# Altium schematic sheet fxloop.SchDoc
size A4
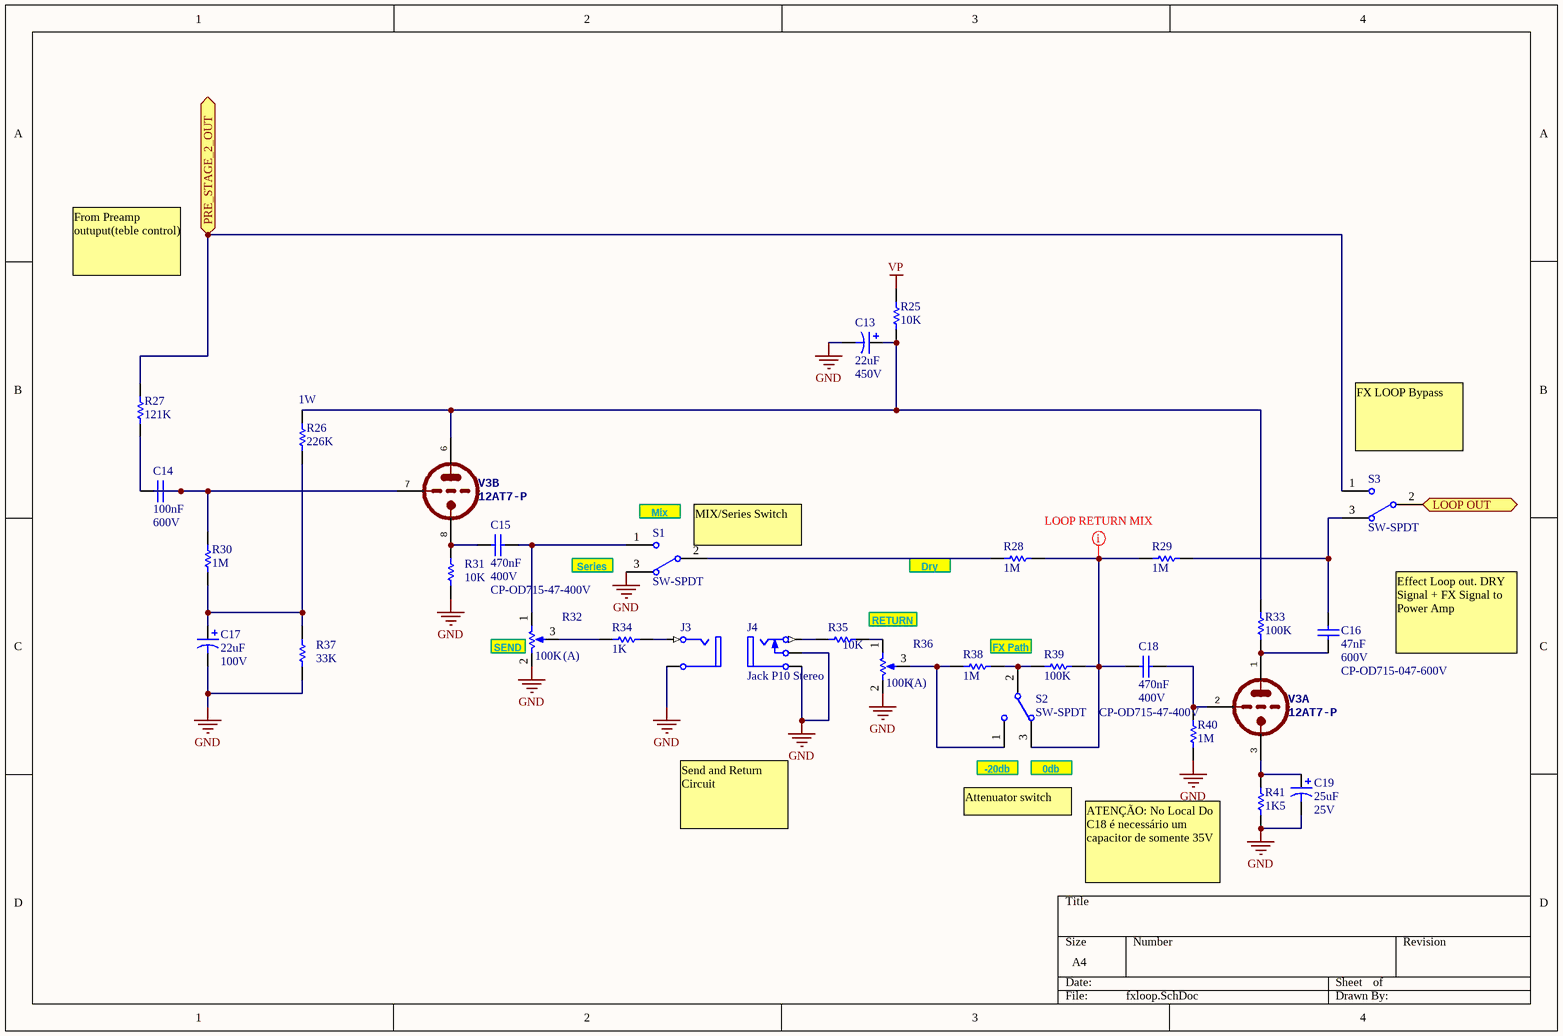
[diagram p0: fxloop.SchDoc]

## Parts
C13  value 22uF  Voltage: 450V  [RAD-POL-7.6-15]  (hidden comment: Cap Pol Rad)
C14  value 100nF  Voltage: 600V  [ORANGE-DROP-100nF]  (hidden comment: Orange Drop Capacitor)
C15  value 470nF  Voltage: 400V  TUBE_DEPOT_SN: CP-OD715-47-400V  [ORANGE-DROP-470-nF-400V]  (hidden comment: Orange Drop Capacitor)
C16  value 47nF  Voltage: 600V  TUBEDEPOT_SN: CP-OD715-047-600V  [ORANGE-DROP-47nF-600V]  (hidden comment: Orange Drop Capacitor)
C17  value 22uF  Voltage: 100V  [RAD-POL-16x20x7.5]  (hidden comment: Cap Pol Radial Vishay 22uF 100V)
C18  value 470nF  Voltage: 400V  TUBE_DEPOT_SN: CP-OD715-47-400V  [ORANGE-DROP-470-nF-400V]  (hidden comment: Orange Drop Capacitor)
C19  value 25uF  Voltage: 25V  [AXIAL-POL-30mm]  (hidden comment: Cap Pol Axial)
J3  Jack Mono  [JACK-MONO-PCB-MINI]  (value not drawn)
J4  Jack P10 Stereo  [JACK-STEREO-3PAD]
R25  value 10K  [AXIAL-0.6]  (hidden comment: Metal Film Resistor 1/2W)
R26  value 226K  Power: 1W  [AXIAL-0.6]  (hidden comment: Metal Film Resistor 1/2W)
R27  value 121K  [AXIAL-0.6]  (hidden comment: Metal Film Resistor 1/2W)
R28  value 1M  [AXIAL-0.6]  (hidden comment: Metal Film Resistor 1/2W)
R29  value 1M  [AXIAL-0.6]  (hidden comment: Metal Film Resistor 1/2W)
R30  value 1M  [AXIAL-0.6]  (hidden comment: Metal Film Resistor 1/2W)
R31  value 10K  [AXIAL-0.6]  (hidden comment: Metal Film Resistor 1/2W)
R32  value 100K  TYPE: (A)  [pot_alpha - 2.54mm]  (hidden comment: ALPHA Potentiometer)
R33  value 100K  [AXIAL-0.6]  (hidden comment: Metal Film Resistor 1/2W)
R34  value 1K  [AXIAL-0.6]  (hidden comment: Metal Film Resistor 1/2W)
R35  value 10K  [AXIAL-0.6]  (hidden comment: Metal Film Resistor 1/2W)
R36  value 100K  TYPE: (A)  [pot_alpha - 2.54mm]  (hidden comment: ALPHA Potentiometer)
R37  value 33K  [AXIAL-0.6]  (hidden comment: Metal Film Resistor 1/2W)
R38  value 1M  [AXIAL-0.6]  (hidden comment: Metal Film Resistor 1/2W)
R39  value 100K  [AXIAL-0.6]  (hidden comment: Metal Film Resistor 1/2W)
R40  value 1M  [AXIAL-0.6]  (hidden comment: Metal Film Resistor 1/2W)
R41  value 1K5  [AXIAL-0.6]  (hidden comment: Metal Film Resistor 1/2W)
S1  SW-SPDT  [SPDT]
S2  SW-SPDT  [SPDT]
S3  SW-SPDT  [SPDT]
V3  12AT7-P  [NOVAL]  (parts A,B of 3)

## Ports
LOOP OUT (out), PRE_STAGE_2_OUT (in)

## Nets
GND: C13.2 C17.2 C19.2 J3.2(S) J4.2(TN) J4.5(S) R31.2 R32.2(BOT) R36.2(BOT) R37.2 R40.1 R41.1 S1.3
VP: R25.2
LOOP OUT: S3.2 ; port LOOP OUT
PRE_STAGE_2_OUT: R27.2 S3.1 ; port PRE_STAGE_2_OUT
NetC13_1: C13.1 R25.1 R26.1 R33.2 V3.6(TA)
NetC14_1: C14.1 R27.1
NetC14_2: C14.2 R30.1 V3.7(TG)
NetC15_1: C15.1 R31.1 V3.8(TK)
NetC15_2: C15.2 R32.1(TOP) S1.1
NetC16_1: C16.1 R33.1 V3.1(TA)
NetC16_2: C16.2 R29.2 S3.3
NetC17_1: C17.1 R26.2 R30.2 R37.1
NetC18_1: C18.1 R28.2 R29.1 R39.2 S2.3
NetC18_2: C18.2 R40.2 V3.2(TG)
NetC19_1: C19.1 R41.2 V3.3(TK)
NetJ3_1: J3.1(T) R34.2
NetJ4_1: J4.1(T) R35.1
NetR28_1: R28.1 S1.2
NetR32_3: R32.3(TAP) R34.1
NetR35_2: R35.2 R36.1(TOP)
NetR36_3: R36.3(TAP) R38.1 S2.1
NetR38_2: R38.2 R39.1 S2.2

## Layout directives
net class Undefined: NetC18_1

## Notes on the sheet
- From Preamp outuput(teble control)
- (near S3) FX LOOP Bypass
- (near S1) Mix
- Series
- (near S1) MIX/Series Switch
- Dry Path
- (near R32) SEND
- RETURN
- FX Path
- Effect Loop out. DRY Signal + FX Signal to Power Amp
- (near S2) -20db
- (near S2) 0db
- Send and Return Circuit
- Attenuator switch
- ATENÇÃO: No Local Do C18 é necessário um capacitor de somente 35V

## Library data of the parts
C13 = Cap Pol Rad: Polarized Capacitor (Axial); Published: 8-Jun-2000; LatestRevisionDate: 17-Jul-2002; LatestRevisionNote: Re-released for DXP Platform.; PackageReference: POLAR0.8; Publisher: Altium Limited; PackageDescription: Polarized Capacitor; 2 Leads
C14 = Cap-Orange-DROP_600V: Capacitor; Published: 8-Jun-2000; LatestRevisionDate: 17-Jul-2002; LatestRevisionNote: Re-released for DXP Platform.; PackageReference: RAD-0.3; Publisher: Altium Limited; PackageDescription: Radial Cap, Thru-Hole; 2 Leads; 0.3 in Pin Spacing
C15 C18 = Cap-Orange-DROP-470nF-400V: Capacitor; ManufacturerPartNumber: 715P47494M; Published: 17-May-2014; LatestRevisionDate: 17-May-2014; LatestRevisionNote: Adding component; PackageReference: Orange Drop; Publisher: Linda HB Amplifiers; PackageDescription: Radial Cap, Thru-Hole; 2 Leads; 9.75mm Pin Spacing
C16 = Cap-Orange-DROP-47nF-600V: Capacitor; ManufacturerPartNumber: 715P47396L; Published: 18-May-2014; LatestRevisionDate: 18-May-2014; LatestRevisionNote: Re-released for DXP Platform.; PackageReference: RAD-0.3; Publisher: Linda HB Amps; PackageDescription: Radial Cap, Thru-Hole; 2 Leads; 0.3 in Pin Spacing
C17 = Cap Pol Radial Vishay 22uF 100V: Vishay 22uF 100V Polarized Capacitor (Radial); 2 Leads; Part Number: 142 RHS; Published: 8-Jun-2000; LatestRevisionDate: 17-Jul-2002; LatestRevisionNote: Re-released for DXP Platform.; PackageReference: POLAR0.8; Publisher: Altium Limited; PackageDescription: Polarized Capacitor; 2 Leads
C19 = Cap Pol Axial: Polarized Capacitor Axial; Published: 8-Jun-2000; LatestRevisionDate: 12-Feb-2014; LatestRevisionNote: Re-released for DXP Platform.; PackageReference: POLAR0.8; Publisher: Whitesheep Amps; PackageDescription: Polarized Capacitor; 2 Leads
J3 = Jack Moto P10: Jack Socket, Thru-Hole, Vertical, 2-Conductor Open Circuit; PackageDocument: 2003; PCB_Layout: Complies with manufacturer's recommendation.; DrillAndSlotSize: Corresponds to nominal value.; LatestRevisionDate: 15-Jul-2004; LatestRevisionNote: Component Replaced.; DatasheetDocument: 2003; PackageReference: S1VS_SNS; Publisher: Altium Limited; ComponentLink1Description: Manufacturer Link; ComponentLink1URL: http://www.cliffuk.co.uk/
J4 = Jack P10 Stereo: Jack Socket, 1/4" [6.5mm], Thru-Hole, Vertical, 2-Conductor with Tip closed; PackageDocument: 2003; PCB_Layout: Complies with manufacturer's recommendation.; DrillAndSlotSize: Corresponds to nominal value.; LatestRevisionDate: 15-Jul-2004; LatestRevisionNote: Component Replaced & renamed from "Phonejack".; DatasheetDocument: 2003; PackageReference: S1VS_SNB; Publisher: Altium Limited; ComponentLink1Description: Manufacturer Link; ComponentLink1URL: http://www.cliffuk.co.uk/
R25-R31 R33-R35 R37-R41 = Res Metal Film 1/2W: Semiconductor Resistor; Published: 8-Jun-2000; LatestRevisionDate: 17-Jul-2002; LatestRevisionNote: 12-Fev-2014; PackageReference: AXIAL-0.6; Publisher: Whitesheep Amps; PackageDescription: Axial Device, Thru-Hole; 2 Leads; 0.5 in Pin Spacing
  R25 R27-R31 R33-R35 R37-R41: Power: 1/2W
R32 R36 = alpha-pot: Potentiometer; Sim Note: Enter the Resistance value and the set point into parameter fields.; Set Position: 0.5; Published: 8-Jun-2000; LatestRevisionDate: 17-Jul-2002; LatestRevisionNote: Re-released for DXP Platform.; PackageReference: VR5; Publisher: Altium Limited; PackageDescription: Variable Resistor, Thru-Hole; 3 Leads
S1-S3 = SW-SPDT: SPDT Subminiature Toggle Switch, Right Angle Mounting, Vertical Actuation; Published: 24-Mar-1999; LatestRevisionDate: 17-Dec-2003; LatestRevisionNote: Schematic revised, PCB Footprint replaced.; DatasheetVersion: 05-Dec-2000; PackageReference: TL36WW15050; Publisher: Altium Limited; PackageDescription: Switch; 4 Leads; ComponentLink1Description: Manufacturer Link; ComponentLink1URL: http://www.apem.com